# Altium schematic sheet motorEncoder.SchDoc: r-one Motor
size A; Date: 08/09/2011; DrawnBy: MRSL; Engineer: MRSL; Organization: Rice University; Revision: V11; SheetNumber: roneV11-motorEncoder; SheetTotal: 6; DocumentName: RoneV11-motorEncoder
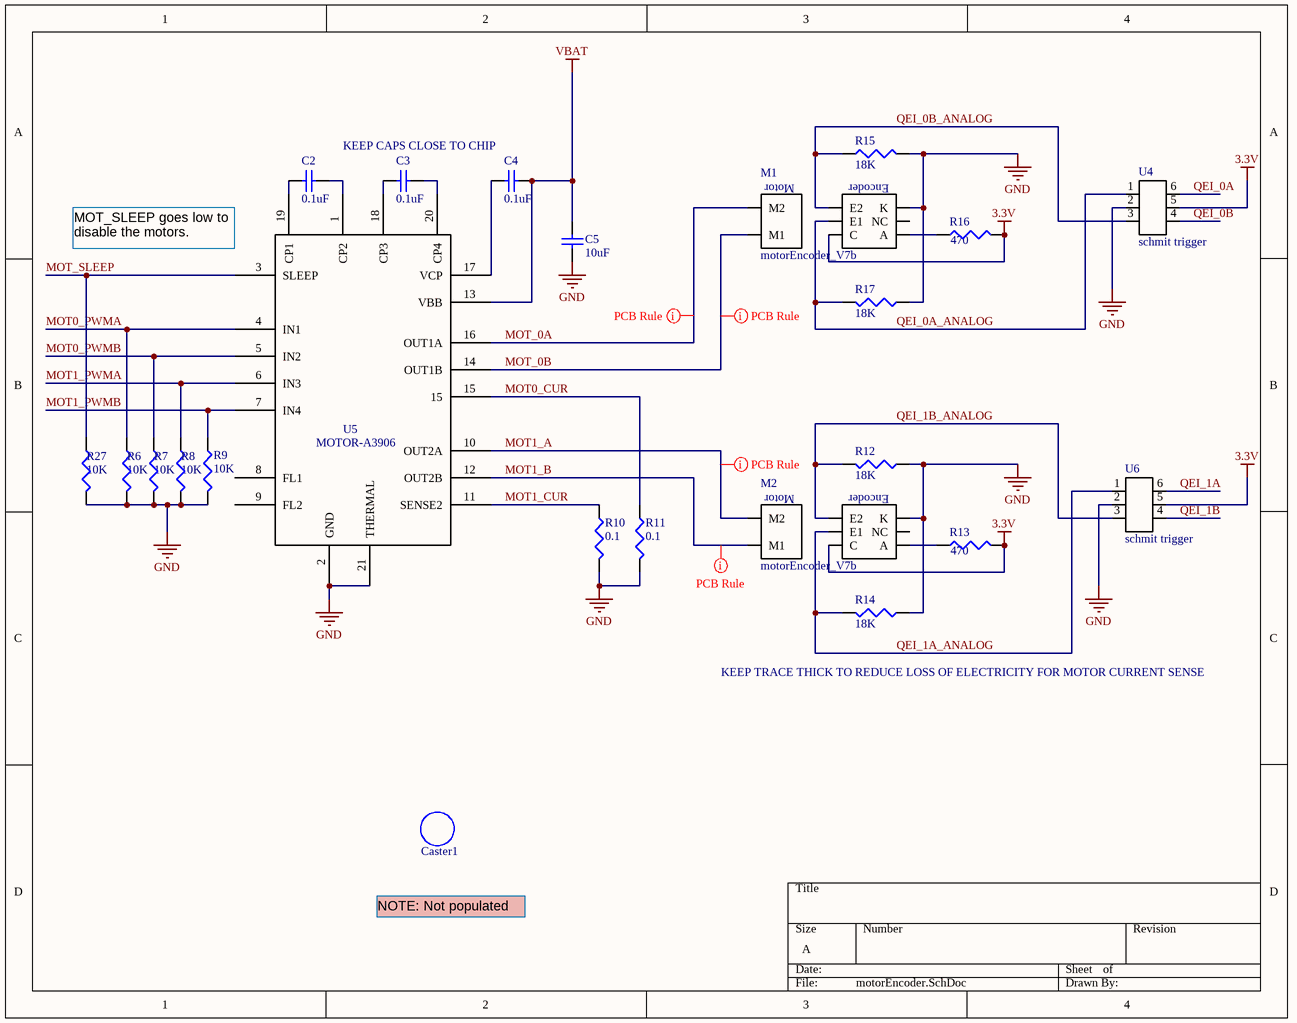
[diagram p0: motorEncoder.SchDoc]

## Parts
C2  value 0.1uF  [CAPC1005L]  (hidden comment: Cap Semi)
C3  value 0.1uF  [CAPC1005L]  (hidden comment: Cap Semi)
C4  value 0.1uF  [CAPC1005L]  (hidden comment: Cap Semi)
C5  value 10uF  [CAPC1608L]  (hidden comment: Cap Semi)
Caster1  non connect  [3/4"CASTER2]  (value not drawn)
M1  motorEncoder_V7b  [motorEncoder_V7b]
M2  motorEncoder_V7b  [motorEncoder_V7b]
R6  value 10K  [RESC1608L]  (hidden comment: Res3)
R7  value 10K  [RESC1608L]  (hidden comment: Res3)
R8  value 10K  [RESC1608L]  (hidden comment: Res3)
R9  value 10K  [RESC1608L]  (hidden comment: Res3)
R10  value 0.1  [RESC1608L]  (hidden comment: Res3)
R11  value 0.1  [RESC1608L]  (hidden comment: Res3)
R12  value 18K  [RESC1608L]
R13  value 470  [RESC1608L]
R14  value 18K  [RESC1608L]
R15  value 18K  [RESC1608L]
R16  value 470  [RESC1608L]
R17  value 18K  [RESC1608L]
R27  value 10K  [CAPC1608L]  (hidden comment: Res3)
U4  schmit trigger  [DCK(R-PDSO-C6)]
U5  MOTOR-A3906  [QFN-20]
U6  schmit trigger  [DCK(R-PDSO-C6)]

## Nets
3.3V: M1.C M2.C R13.2 R16.2 U4.5 U6.5
GND: C5.1 M1.K M2.K R6.2 R7.2 R8.2 R9.2 R10.2 R11.2 R12.1 R14.1 R15.2 R17.1 R27.2 U4.2 U5.2(GND) U5.21(THERMAL) U6.2
VBAT: C4.1 C5.2 U5.13(VBB)
MOT0_CUR: R11.1 U5.15
MOT0_PWMA: R6.1 U5.4(IN1)
MOT0_PWMB: R7.1 U5.5(IN2)
MOT1_A: M2.M2 U5.10(OUT2A)
MOT1_B: M2.M1 U5.12(OUT2B)
MOT1_CUR: R10.1 U5.11(SENSE2)
MOT1_PWMA: R8.1 U5.6(IN3)
MOT1_PWMB: R9.1 U5.7(IN4)
MOT_0A: M1.M2 U5.16(OUT1A)
MOT_0B: M1.M1 U5.14(OUT1B)
MOT_SLEEP: R27.1 U5.3(SLEEP)
QEI_0A: U4.6
QEI_0A_ANALOG: M1.E1 R17.2 U4.1
QEI_0B: U4.4
QEI_0B_ANALOG: M1.E2 R15.1 U4.3
QEI_1A: U6.6
QEI_1A_ANALOG: M2.E1 R14.2 U6.1
QEI_1B: U6.4
QEI_1B_ANALOG: M2.E2 R12.2 U6.3
NetC2_1: C2.1 U5.19(CP1)
NetC2_2: C2.2 U5.1(CP2)
NetC3_1: C3.1 U5.18(CP3)
NetC3_2: C3.2 U5.20(CP4)
NetC4_2: C4.2 U5.17(VCP)
NetM1_A: M1.A R16.1
NetM2_A: M2.A R13.1

Not connected (* = marked no-connect by the designer): M1 NC; M2 NC; U5 8(FL1) 9(FL2)

## Layout directives
rule Width Constraint [Pref Width = 20mil    Min Width = 10mil    Max Width = 25mil]: MOT1_A, MOT1_B, MOT_0A, MOT_0B

## Notes on the sheet
- KEEP CAPS CLOSE TO CHIP
- (near U5) MOT_SLEEP goes low to disable the motors.
- KEEP TRACE THICK TO REDUCE LOSS OF ELECTRICITY FOR MOTOR CURRENT SENSE
- NOTE: Not populated
- (in symbol motorEncoder_V7b) Motor; Encoder

## Library data of the parts
C2-C5 = Cap Semi: Capacitor (Semiconductor SIM Model); Published: 8-Jun-2000; LatestRevisionDate: 29-May-2009; LatestRevisionNote: IPC-7351 Footprint Added.; PackageReference: C1206; Publisher: Altium Limited; PackageDescription: Chip Capacitor
Caster1 = Caster 3/4in: This is just a space saver to get the caster onto the pcb
R6-R17 R27 = Res3: Resistor; Published: 8-Jun-2000; LatestRevisionDate: 29-May-2009; LatestRevisionNote: IPC-7351 Footprint Added.; PackageReference: J1-0603; Publisher: Altium Limited; PackageDescription: Chip Resistor